# Altium schematic sheet Level Sensor.SchDoc
size A
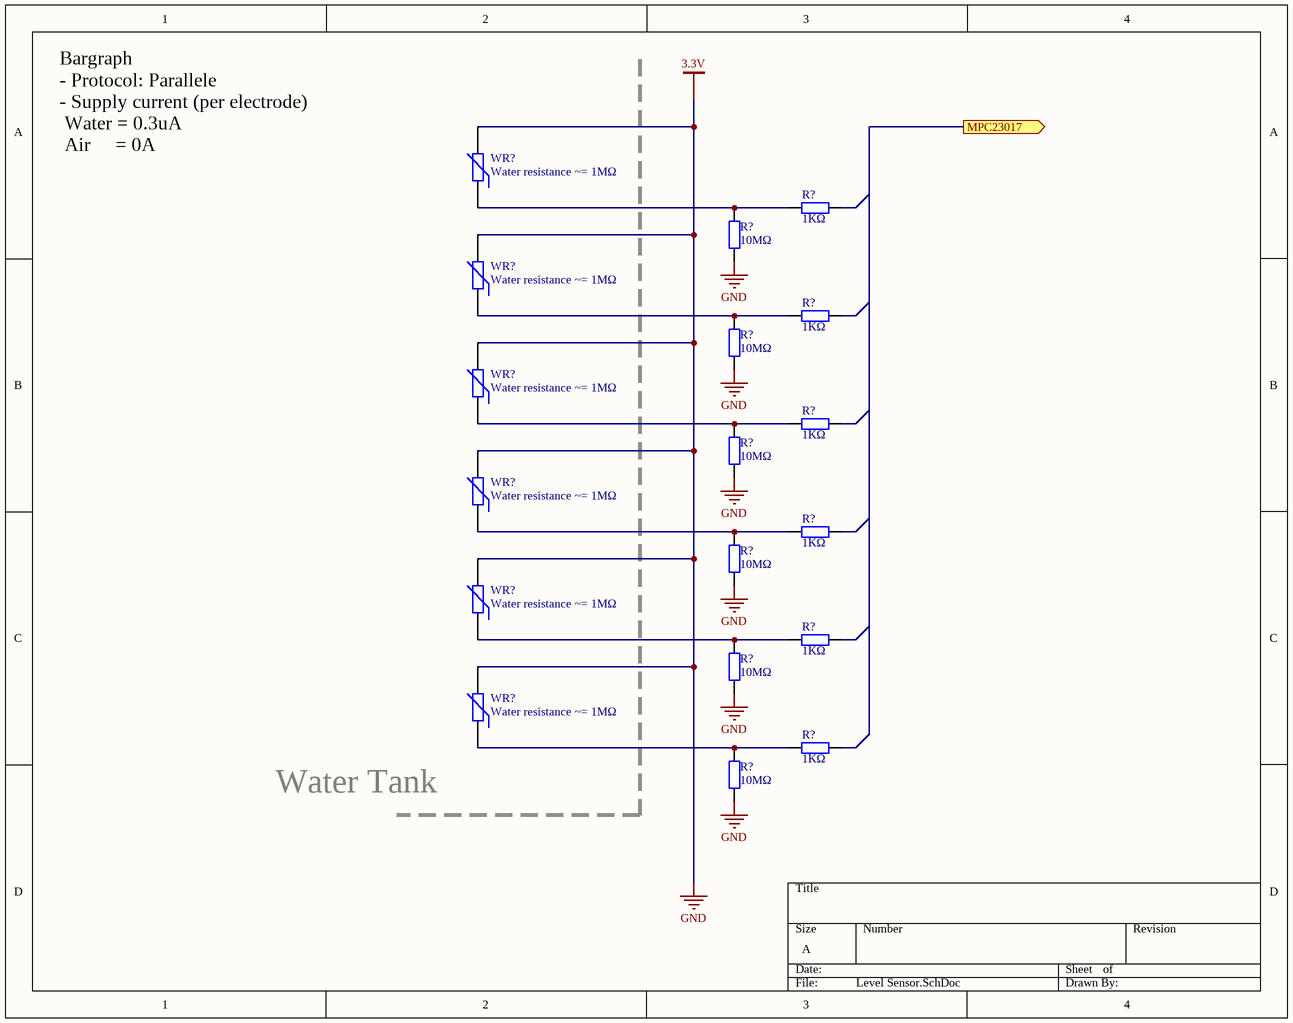
[diagram p0: Level Sensor.SchDoc]

## Parts
(Parts that share a designator on the sheet are numbered #1, #2 ... from top to bottom, then left to right.)
R?#1  1KΩ  [AXIAL-0.4]
R?#2  10MΩ  [AXIAL-0.4]
R?#3  1KΩ  [AXIAL-0.4]
R?#4  10MΩ  [AXIAL-0.4]
R?#5  1KΩ  [AXIAL-0.4]
R?#6  10MΩ  [AXIAL-0.4]
R?#7  1KΩ  [AXIAL-0.4]
R?#8  10MΩ  [AXIAL-0.4]
R?#9  1KΩ  [AXIAL-0.4]
R?#10  10MΩ  [AXIAL-0.4]
R?#11  1KΩ  [AXIAL-0.4]
R?#12  10MΩ  [AXIAL-0.4]
WR?#1  Water resistance ~= 1MΩ  [6-0805_N]
WR?#2  Water resistance ~= 1MΩ  [6-0805_N]
WR?#3  Water resistance ~= 1MΩ  [6-0805_N]
WR?#4  Water resistance ~= 1MΩ  [6-0805_N]
WR?#5  Water resistance ~= 1MΩ  [6-0805_N]
WR?#6  Water resistance ~= 1MΩ  [6-0805_N]

## Ports
MPC23017 (out)

## Nets
3.3V: R?#2.1 R?#4.1 R?#6.1 R?#8.1 R?#10.1 R?#12.1 WR?#1.2 WR?#2.2 WR?#3.2 WR?#4.2 WR?#5.2 WR?#6.2  [also labelled GND]
NetR?#1_2: R?#1.2 R?#2.2 WR?#1.1
NetR?#3_2: R?#3.2 R?#4.2 WR?#2.1
NetR?#5_2: R?#5.2 R?#6.2 WR?#3.1
NetR?#7_2: R?#7.2 R?#8.2 WR?#4.1
NetR?#9_2: R?#9.2 R?#10.2 WR?#5.1
NetR?#11_2: R?#11.2 R?#12.2 WR?#6.1

Not connected (* = marked no-connect by the designer): R?#1 1; R?#3 1; R?#5 1; R?#7 1; R?#9 1; R?#11 1

## Notes on the sheet
- Bargraph
  - Protocol: Parallele
  - Supply current (per electrode)
  Water = 0.3uA
  Air     = 0A
- Water Tank

## Library data of the parts
R?#1-R?#12 = Res2: Resistor; Value: 1K; Published: 8-Jun-2000; LatestRevisionDate: 17-Jul-2002; LatestRevisionNote: Re-released for DXP Platform.; PackageReference: AXIAL-0.4; Publisher: Altium Limited; PackageDescription: Axial Device, Thru-Hole; 2 Leads; 0.4 in Pin Spacing
WR?#1-WR?#6 = Res Varistor: Varistor (Voltage-Sensitive Resistor); Published: 24-Mar-1999; LatestRevisionDate: 29-May-2009; LatestRevisionNote: IPC-7351 Footprint Added.; PackageVersion: Mar-2003; PackageReference: 6-0805; Publisher: Altium Limited; PackageDescription: Chip Resistor 0805 Case Size; Code_IPC: RESC2012